# Altium schematic sheet CT.SchDoc
size Tabloid
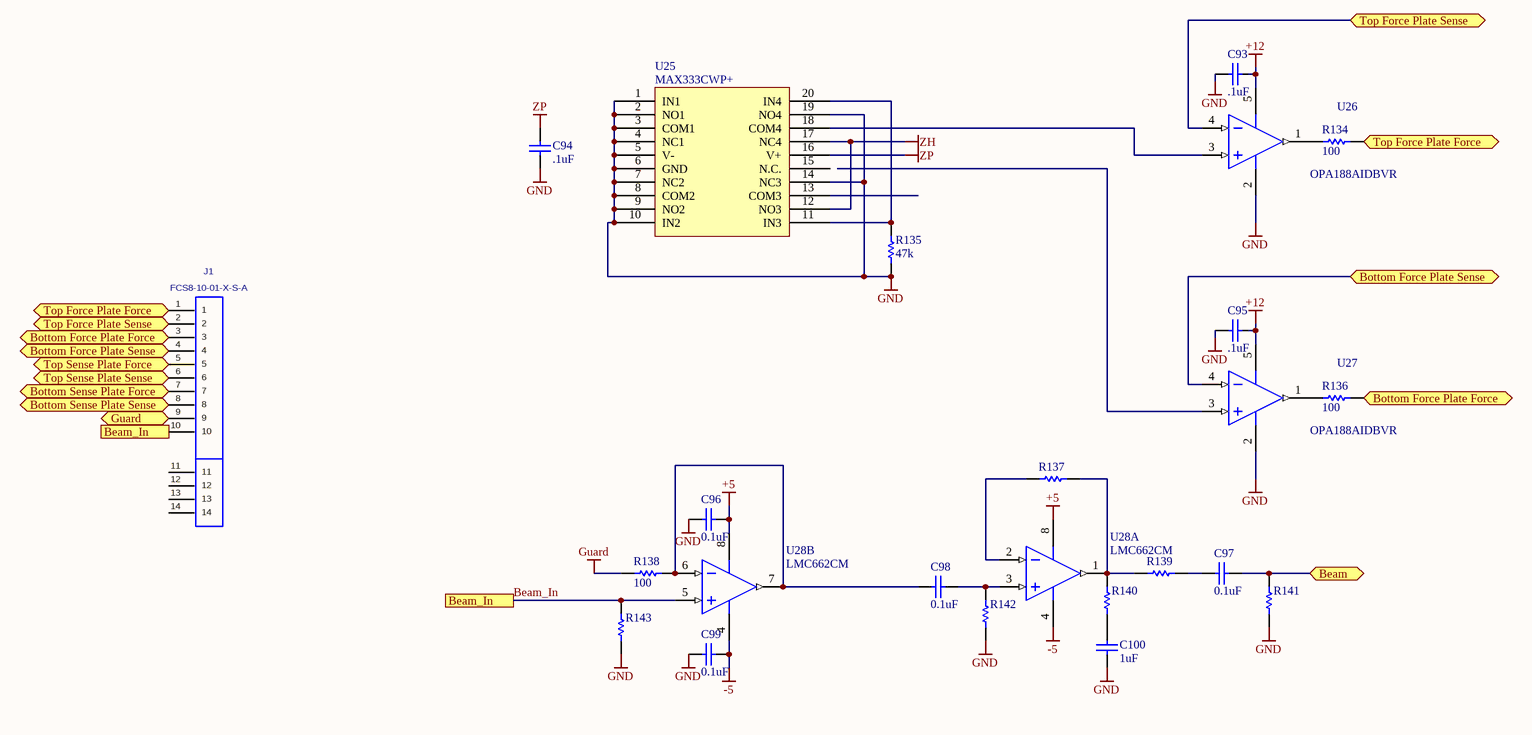
[diagram p0: CT.SchDoc]

## Parts
C93  .1uF  [CAPC0805(2012)75_M]
C94  .1uF  [CAPC0805(2012)75_L]
C95  .1uF  [CAPC0805(2012)75_M]
C96  0.1uF  [CAPC0402(1005)60_L]
C97  0.1uF  [CAPC0402(1005)60_L]
C98  0.1uF  [CAPC0402(1005)60_L]
C99  0.1uF  [CAPC0402(1005)60_L]
C100  1uF  [CAPC0402(1005)60_L]
J1  FCS8-10-01-X-S-A  [FCS8-10-01-X-S-A]
R134  100  [RESC0805(2012)_L]
R135  47k  [RESC0805(2012)_L]
R136  100  [RESC0805(2012)_L]
R137  (no value)  [RESC0402(1005)_M]
R138  100  [RESC0402(1005)_M]
R139  (no value)  [RESC0402(1005)_M]
R140  (no value)  [RESC0402(1005)_M]
R141  (no value)  [RESC0402(1005)_M]
R142  (no value)  [RESC0402(1005)_M]
R143  (no value)  [RESC0402(1005)_M]
U25  MAX333CWP+  [TSOP65P640X90-20N]
U26  OPA188AIDBVR  [DBV0005A_M]
U27  OPA188AIDBVR  [DBV0005A_M]
U28  LMC662CM  [D0008A_M]  (parts A,B of 2)

## Ports
Beam, Beam_In, Bottom Force Plate Force, Bottom Force Plate Sense, Bottom Sense Plate Force, Bottom Sense Plate Sense, Guard, Top Force Plate Force, Top Force Plate Sense, Top Sense Plate Force, Top Sense Plate Sense

## Nets
+5: C96.2 U28.8(V+)
+12: C93.2 C95.2 U26.5(V+) U27.5(V+)
-5: C99.2 U28.4(V-)
GND: C93.1 C94.1 C95.1 C96.1 C99.1 C100.1 R135.2 R141.2 R142.2 R143.1 U25.1(IN1) U25.2(NO1) U25.3(COM1) U25.4(NC1) U25.5(V-) U25.6(GND) U25.7(NC2) U25.8(COM2) U25.9(NO2) U25.10(IN2) U25.14(NC3) U25.19(NO4) U26.2(V-) U27.2(V-)
Guard: R138.2
ZH: U25.12(NO3) U25.17(NC4)
ZP: C94.2 U25.16(V+)
Beam: C97.2 R141.1 ; port Beam
Beam_In: J1.10 R143.2 U28.5(INB+) ; port Beam_In
Bottom Force Plate Force: J1.3 R136.2 ; port Bottom Force Plate Force
Bottom Force Plate Sense: J1.4 U27.4(IN-) ; port Bottom Force Plate Sense
Bottom Sense Plate Force: J1.7 ; port Bottom Sense Plate Force
Bottom Sense Plate Sense: J1.8 ; port Bottom Sense Plate Sense
Guard: J1.9 ; port Guard  [a separate net that carries the same name]
Top Force Plate Force: J1.1 R134.2 ; port Top Force Plate Force
Top Force Plate Sense: J1.2 U26.4(IN-) ; port Top Force Plate Sense
Top Sense Plate Force: J1.5 ; port Top Sense Plate Force
Top Sense Plate Sense: J1.6 ; port Top Sense Plate Sense
NetC97_1: C97.1 R139.1
NetC98_1: C98.1 R138.1 U28.6(INB-) U28.7(OUTB)
NetC98_2: C98.2 R142.1 U28.3(INA+)
NetC100_2: C100.2 R140.2
NetR134_1: R134.1 U26.1(OUT)
NetR135_1: R135.1 U25.11(IN3) U25.20(IN4)
NetR136_1: R136.1 U27.1(OUT)
NetR137_1: R137.1 R139.2 R140.1 U28.1(OUTA)
NetR137_2: R137.2 U28.2(INA-)
NetU25_18: U25.18(COM4) U26.3(IN+)

Not connected (* = marked no-connect by the designer): J1 11 12 13 14; U25 13(COM3) 15(N.C.); U27 3(IN+)

## Notes on the sheet
- Title
- Size:
- Date:
- Tabloid
- Number:
- Time:
- Revision:
- Sheet
- of
- ZLS Corporation
- 7801 North Lamar Blvd.
- Suite E-184
- Austin, Texas 78752  USA
- (512) 453-0288
- File:

## Library data of the parts
C93 C95 = CMP-1036-01414-1: CAP 33pF 25V ±2% 0805 (2012 Metric) Thickness 0.75mm SMD; Tolerance: Â±2%; Case-Metric: 2012; Case-EIA: 0805; Value: .1uF; Max Thickness: 0.75 mm; Rated Voltage: 25 V; Technology: SMT
C94 = CMP-1036-02117-1: CAP 150pF 16V ±10% 0805 (2012 Metric) Thickness 0.75mm SMD; Case-EIA: 0805; Tolerance: Â±10%; Case-Metric: 2012; Technology: SMT; Max Thickness: 0.75 mm; Rated Voltage: 16 V; Value: .1uF
C96-C100 = CMP-1034-00252-1: CAP CER 0.1UF 10V X7R 0402; Manufacturer: Murata Electronics North America; Manufacturer Part Number: GRM155R71A104KA01D; Tolerance: ±10%; Supplier 1: Digi-Key; Supplier Part Number 1: 490-6321-1-ND; RoHS: RoHS Compliant; Category: Capacitors; Stock 1: 2920395; Pricing 1: 1=0.1, 10=0.014, 100=0.0063, 500=0.00446, 1000=0.00351, 2500=0.00319, 5000=0.00293 (USD); Packaging: Cut Tape (CT); Part Status: Active; Voltage - Rated: 10V; Temperature Coefficient: X7R; Operating Temperature: -55°C ~ 125°C; Features: -; Ratings: -; Applications: General Purpose; Mounting Type: Surface Mount, MLCC; Package / Case: 0402 (1005 Metric); Size / Dimension: 0.039" L x 0.020" W (1.00mm x 0.50mm); Height - Seated (Max): -; Thickness (Max): 0.022" (0.55mm); Lead Spacing: -; ComponentLink1URL: http://www.murata.com/~/media/webrenewal/support/library/catalog/products/capacitor/mlcc/c02e.ashx?la=en-us; ComponentLink1Description: http://www.murata.com/~/media/webrenewal/support/library/catalog/products/capacitor/mlcc/c02e.ashx?la=en-us
J1 = FCS8-10-01-X-S-A: FCS8 Socket Assembly, 20-Pins, w/ Alignment Pins; MANUFACTURER: SAMTEC; CREATED: 31 NOV 2013 - WENDY XIN; PCB DECAL: FCS8-10-01-X-S-A
R134-R136 = CMP-1013-00215-1: 2R55 0.125W 1% 0805 (2012 Metric)  SMD; Case-Metric: 2012; Case-EIA: 0805; Tolerance: 1 %; Technology: SMT; Power: 0.125 W
  R134 R136: Value: 100
  R135: Value: 47k
R137-R143 = CMP-1011-00463-1
U25 = MAX333CWP+: IC SWITCH QUAD SPDT 20TSSOP; Manufacturer: Maxim; Manufacturer Part Number: MAX333AEUP+; Max Supply Voltage: 30V; Min Supply Voltage: 10V; Min Dual Supply Voltage: 4.5V; Max Dual Supply Voltage: 20V; On-State Resistance: 35R; Operating Supply Current: 1uA; Supply Type: Single,Dual; Max Power Dissipation: 559mW; Turn-On Delay Time: 175ns; Turn-Off Delay Time: 145ns; Max Supply Current: 250uA; Number of Bits: 4; Dual Supply Voltage: 15V; Supplier 1: Mouser; Supplier Part Number 1: 700-MAX333AEUP; Stock 1: 664; Pricing 1: 1=6.77, 10=6.43, 50=5.8, 100=5.8, 1000=5.62, 10000=5.62 (USD); Case/Package: TSSOP; Number of Pins: 20; Weight: 0.006737oz; Min Operating Temperature: -40°C; Max Operating Temperature: 85°C; Packaging: Rail/Tube; Package Quantity: 74; Throw Configuration: SPDT; Number of Channels: 4; Length: 6.6mm; Height: 0.95mm; Width: 4.5mm; Radiation Hardening: No; Lead Free: Lead Free; REACH SVHC: Unknown; ComponentLink1URL: https://datasheet.ciiva.com/2978/max333a-2978850.pdf; ComponentLink1Description: https://datasheet.ciiva.com/2978/max333a-2978850.pdf; ComponentLink2URL: https://datasheet.ciiva.com/30478/0900766b81253c85-30478260.pdf; ComponentLink2Description: https://datasheet.ciiva.com/30478/0900766b81253c85-30478260.pdf; ComponentLink3URL: https://datasheet.ciiva.com/1674/max333a-1674617.pdf; ComponentLink3Description: https://datasheet.ciiva.com/1674/max333a-1674617.pdf; ComponentLink4URL: https://datasheet.ciiva.com/26825/max333aeup-26825546.pdf; ComponentLink4Description: https://datasheet.ciiva.com/26825/max333aeup-26825546.pdf
U26 U27 = CMP-0809-00005-2: Precision, Low Noise, Rail-to-Rail Output, Zero-Drift Operational Amplifier, 4 to 36 V, -40 to 125 degC, 5-pin SOT23 (DBV5), Green (RoHS & no Sb/Br); Manufacturer: Texas Instruments; Total Supply Voltage(Min)(+5V is 5, +/-5V is 10): 4; Offset Drift(Typ)(uV/C): 0.03; Rating: Catalog; SubFamily: Zero Drift Precision Amplifier; GBW(Typ)(MHz): 2; Slew Rate(Typ)(V/us): 0.8; Number of Channels: 1; CMRR(Min)(dB): 120; Iq per channel(Max)(mA): 0.51; Total Supply Voltage(Max)(+5V is 5, +/-5V is 10): 36; PartNumber: OPA188AIDBVR; ComponentLink2Description: Datasheet; ComponentLink2URL: http://www.ti.com/lit/ds/symlink/opa188.pdf; ComponentLink1Description: Manufacturer URL; Mounting Technology: Surface Mount; Eco-Plan: Green (RoHS & no Sb/Br); ComponentLink1URL: http://www.ti.com/; PackageVersion: 4073253-4/K, 03/2006; DatasheetVersion: SBOS642A; ComponentLink3Description: Package Specification; PackageReference: DBV0005A; ComponentLink3URL: http://www.ti.com/litv/pdf/mpds018i; PackageDescription: 5-Pin Plastic Small Outline, Body 1.6 x 2.9 mm, Pitch 0.95 mm; Code_JEDEC: MO-178
U28 = CMP-0055-00893-3: CMOS Dual Operational Amplifier, 8-pin Narrow SOIC; Manufacturer: Texas Instruments; PowerWise: N; CompType: Amplifiers; PackageTopMarking: NSZXTT*LMC66*2CM; RoHS: N; ComponentLink1Description: Datasheet URL; PinCount: 8; Code_IPC: SOIC127P600-8; ComponentLink1URL: http://www.ti.com/general/docs/lit/getliterature.tsp?genericPartNumber=LMC662&fileType=pdf; Code_JEDEC: MS-012-AA; PackageDescription: SOIC Narrow, 4.9 x 3.9 x 1.45mm, 8 Lead, 1.27mm Pitch; Package Reference: D0008A; PartId: 1